# Altium schematic sheet TTL-RS485.SchDoc
size 420 x 297 mm; Author: Nguyễn Huy Hoàng; SheetNumber: 2; SheetTotal: 5; Instructor: Nguyễn Trung Hiếu
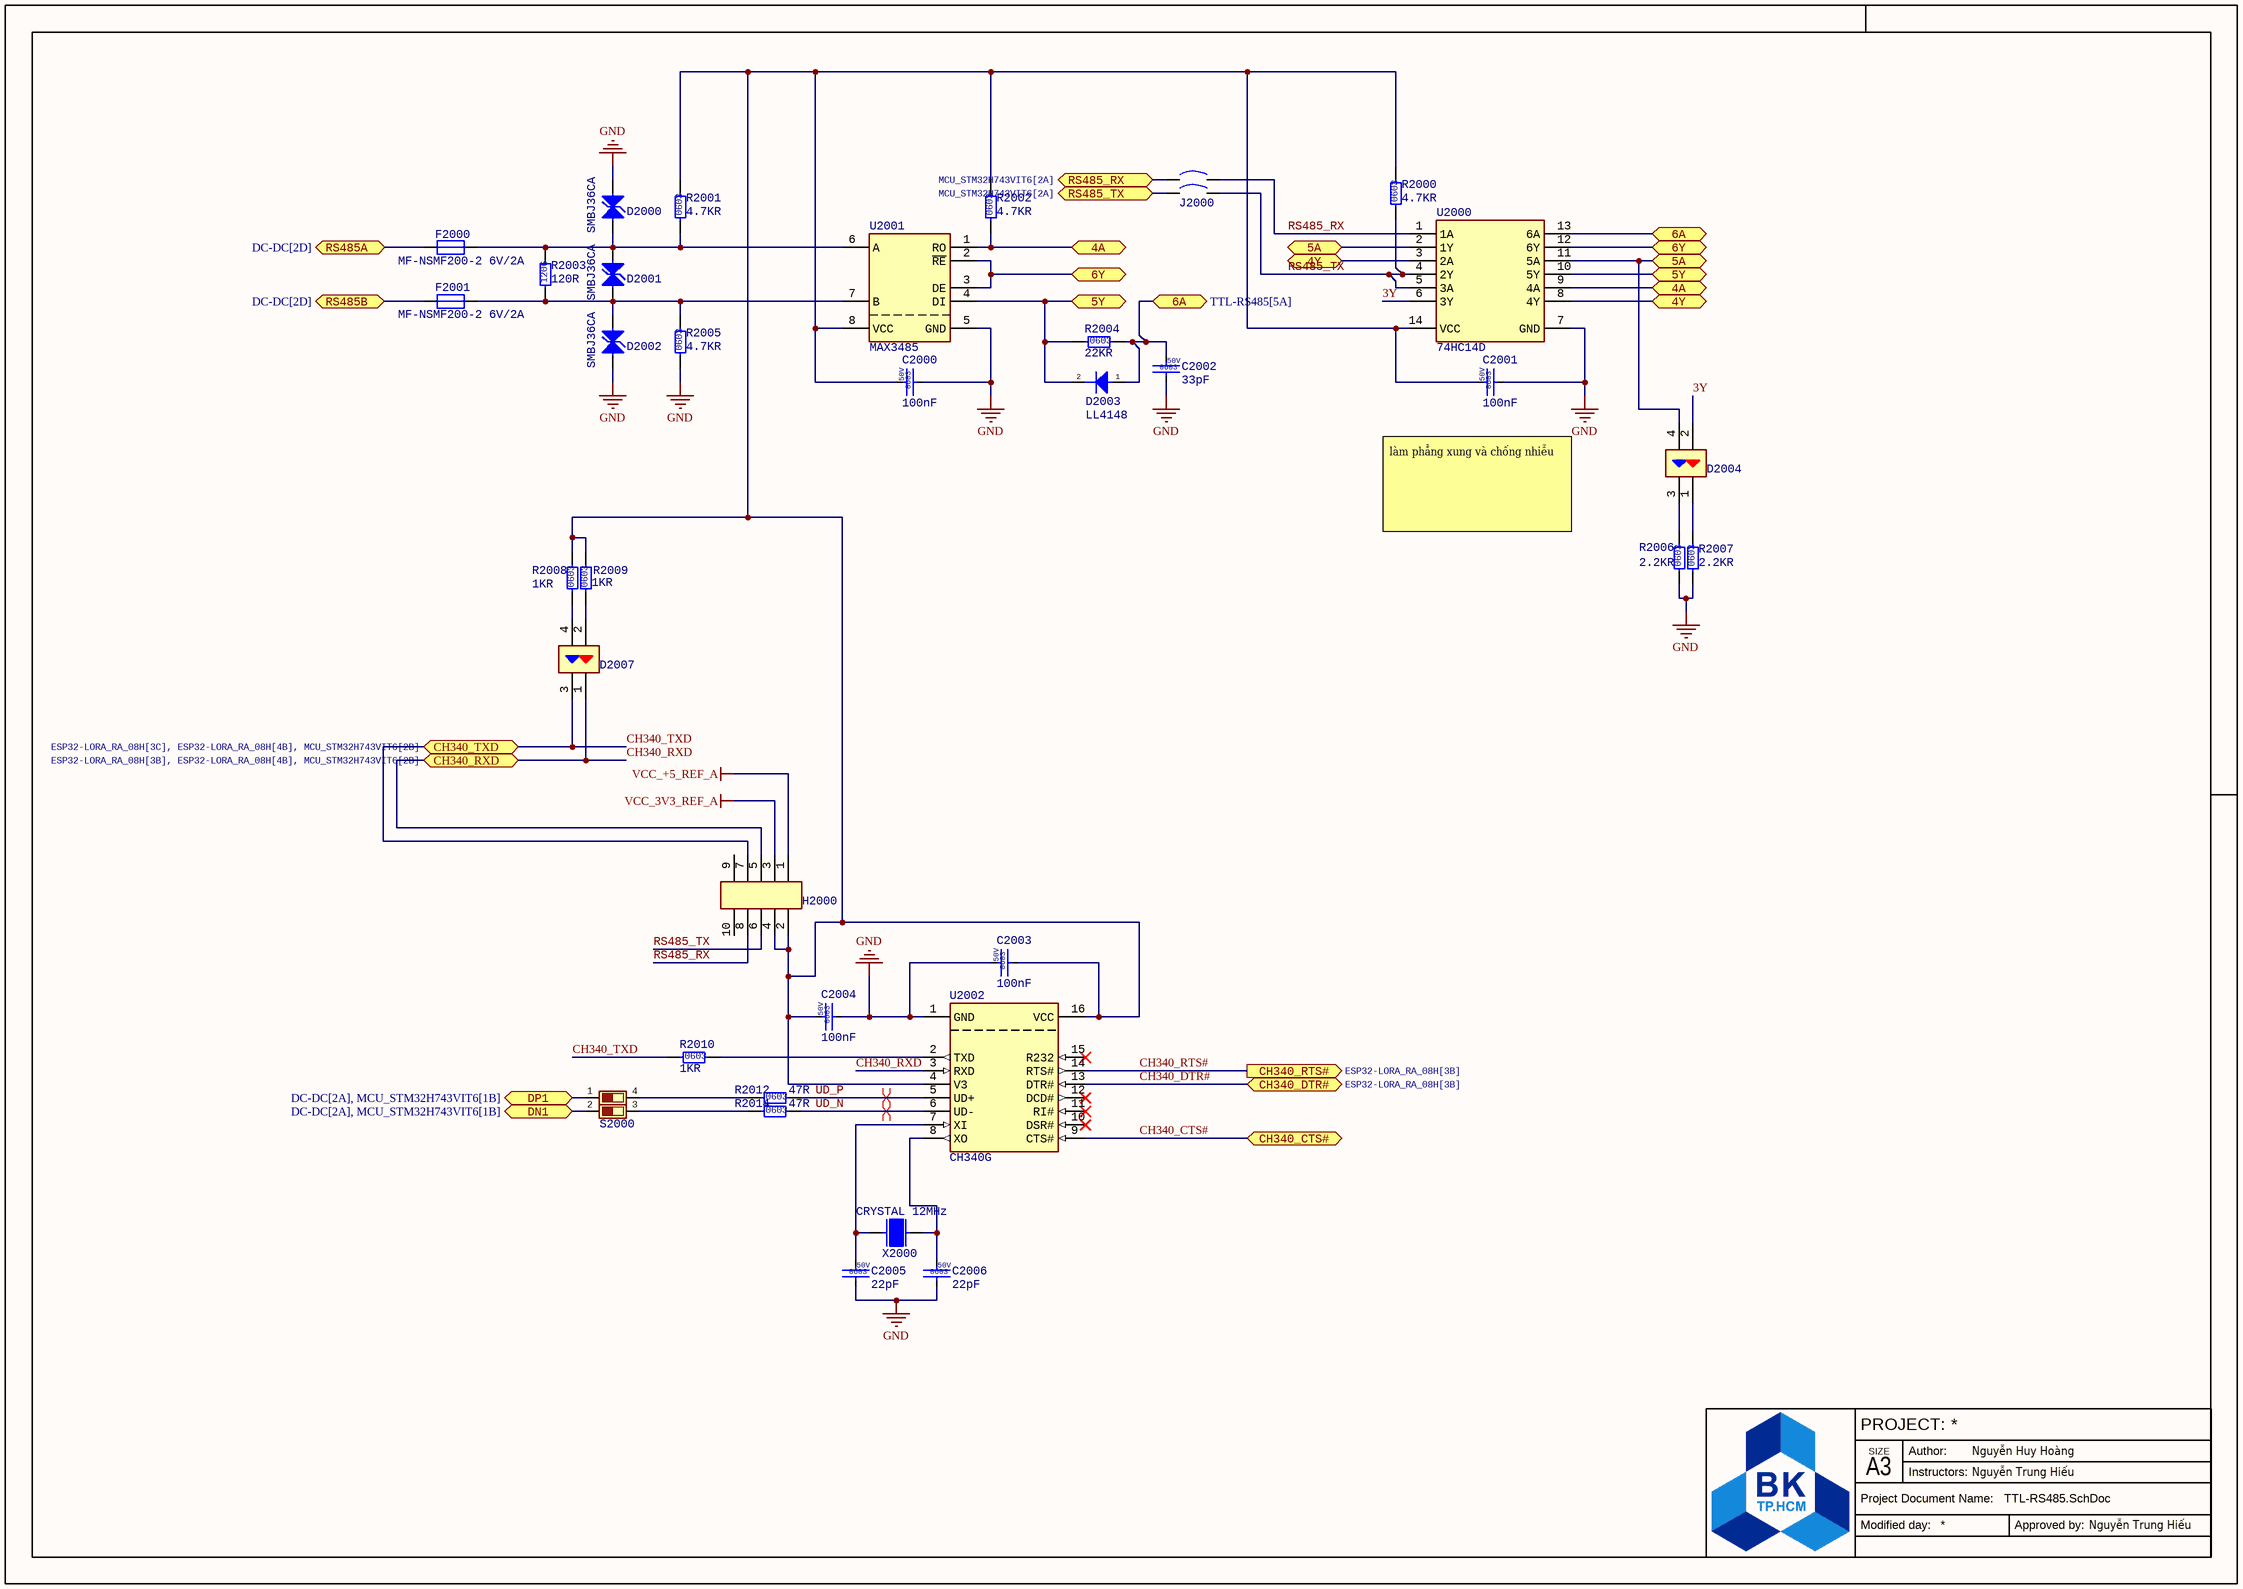
[diagram p0: TTL-RS485.SchDoc]

## Parts
C2000  100nF  Voltage: 50V  Size: 0603  [CAP CER 0603]
C2001  100nF  Voltage: 50V  Size: 0603  [CAP CER 0603]
C2002  33pF  Voltage: 50V  Size: 0603  [CAP CER 0603]
C2003  100nF  Voltage: 50V  Size: 0603  [CAP CER 0603]
C2004  100nF  Voltage: 50V  Size: 0603  [CAP CER 0603]
C2005  22pF  Voltage: 50V  Size: 0603  [CAP CER 0603]
C2006  22pF  Voltage: 50V  Size: 0603  [CAP CER 0603]
D2000  SMBJ36CA  [DO-214AA]
D2001  SMBJ36CA  [DO-214AA]
D2002  SMBJ36CA  [DO-214AA]
D2003  LL4148  [SOD-80]
D2004  LED R/B 0805  [LED RB 0805]  (value not drawn)
D2007  LED R/B 0805  [LED RB 0805]  (value not drawn)
F2000  MF-NSMF200-2 6V/2A  [FUSE 1206]
F2001  MF-NSMF200-2 6V/2A  [FUSE 1206]
H2000  HEADER 5X2  [HEADER 5X2]  (value not drawn)
J2000  JUMPER 2X2  [JUMPER 2X2]  (value not drawn)
R2000  4.7KR  Size: 0603  [RESC 0603(1608) SMD]
R2001  4.7KR  Size: 0603  [RESC 0603(1608) SMD]
R2002  4.7KR  Size: 0603  [RESC 0603(1608) SMD]
R2003  120R  Size: 1206  [RESC 1206(3116) SMD]
R2004  22KR  Size: 0603  [RESC 0603(1608) SMD]
R2005  4.7KR  Size: 0603  [RESC 0603(1608) SMD]
R2006  2.2KR  Size: 0603  [RESC 0603(1608) SMD]
R2007  2.2KR  Size: 0603  [RESC 0603(1608) SMD]
R2008  1KR  Size: 0603  [RESC 0603(1608) SMD]
R2009  1KR  Size: 0603  [RESC 0603(1608) SMD]
R2010  1KR  Size: 0603  [RESC 0603(1608) SMD]
R2012  47R  Size: 0603  [RESC 0603(1608) SMD]
R2014  47R  Size: 0603  [RESC 0603(1608) SMD]
S2000  DIP-2  [DIP-2 SWITCH]  (value not drawn)
U2000  74HC14D  [SOIC-14]
U2001  MAX3485  [SOP-8]
U2002  CH340G  [SOP-16]
X2000  CRYSTAL 12MHz  [CRYSTAL 5032 2PIN]

## Ports
4A (bidir, see TTL-RS485[3A]), 4A (bidir, see TTL-RS485[5A]), 4Y (bidir, see TTL-RS485[4A]), 4Y (bidir, see TTL-RS485[5A]), 5A (bidir, see TTL-RS485[4A]), 5A (bidir, see TTL-RS485[5A]), 5Y (bidir, see TTL-RS485[3A]), 5Y (bidir, see TTL-RS485[5A]), 6A (bidir, see TTL-RS485[4A]), 6A (bidir, see TTL-RS485[5A]), 6Y (bidir, see TTL-RS485[3A]), 6Y (bidir, see TTL-RS485[5A]), CH340_CTS# (bidir), CH340_DTR# (bidir, see ESP32-LORA_RA_08H[3B]), CH340_RTS# (out, see ESP32-LORA_RA_08H[3B]), CH340_RXD (bidir, see ESP32-LORA_RA_08H[3B], ESP32-LORA_RA_08H[4B], MCU_STM32H743VIT6[2B]), CH340_TXD (bidir, see ESP32-LORA_RA_08H[3C], ESP32-LORA_RA_08H[4B], MCU_STM32H743VIT6[2B]), DN1 (bidir, see DC-DC[2A], MCU_STM32H743VIT6[1B]), DP1 (bidir, see DC-DC[2A], MCU_STM32H743VIT6[1B]), RS485_RX (bidir, see MCU_STM32H743VIT6[2A]), RS485_TX (bidir, see MCU_STM32H743VIT6[2A]), RS485A (bidir, see DC-DC[2D]), RS485B (bidir, see DC-DC[2D])

## Nets
GND: C2000.2 C2001.2 C2002.2 C2003.1 C2004.2 C2005.2 C2006.2 D2000.1 D2002.2 R2005.1 R2006.1 R2007.1 U2000.7(GND) U2001.5(GND) U2002.1(GND)
VCC_3V3_REF_A: H2000.3
VCC_+5_REF_A: H2000.1
3Y: D2004.2 U2000.6(3Y)
4A: R2002.1 U2000.9(4A) U2001.1(RO) ; port 4A
4Y: U2000.3(2A) U2000.8(4Y) ; port 4Y
5A: D2004.4 U2000.2(1Y) U2000.11(5A) ; port 5A
5Y: D2003.2(K) R2004.1 U2000.10(5Y) U2001.4(DI) ; port 5Y
6A: C2002.1 D2003.1(A) R2004.2 U2000.13(6A) ; port 6A
6Y: U2000.12(6Y) U2001.2(~{RE}) U2001.3(DE) ; port 6Y
CH340_CTS#: U2002.9(CTS#) ; port CH340_CTS#
CH340_DTR#: U2002.13(DTR#) ; port CH340_DTR#
CH340_RTS#: U2002.14(RTS#) ; port CH340_RTS#
CH340_RXD: D2007.1 H2000.5 U2002.3(RXD) ; port CH340_RXD
CH340_TXD: D2007.3 H2000.7 R2010.1 ; port CH340_TXD
DN1: S2000.2 ; port DN1
DP1: S2000.1 ; port DP1
RS485_RX: H2000.8 J2000.2 U2000.1(1A)
RS485_RX: J2000.1 ; port RS485_RX  [a separate net that carries the same name]
RS485_TX: H2000.6 J2000.4 R2000.1 U2000.4(2Y) U2000.5(3A)
RS485_TX: J2000.3 ; port RS485_TX  [a separate net that carries the same name]
RS485A: F2000.1 ; port RS485A
RS485B: F2001.1 ; port RS485B
UD_N: R2014.2 U2002.6(UD-)
UD_P: R2012.2 U2002.5(UD+)
NetC2000_1: C2000.1 C2001.1 C2003.2 C2004.1 H2000.2 H2000.4 R2000.2 R2001.2 R2002.2 R2008.2 R2009.2 U2000.14(VCC) U2001.8(VCC) U2002.4(V3) U2002.16(VCC)
NetC2005_1: C2005.1 U2002.7(XI) X2000.1
NetC2006_1: C2006.1 U2002.8(XO) X2000.2
NetD2000_2: D2000.2 D2001.1 F2000.2 R2001.1 R2003.2 U2001.6(A)
NetD2001_2: D2001.2 D2002.1 F2001.2 R2003.1 R2005.2 U2001.7(B)
NetD2004_1: D2004.1 R2007.2
NetD2004_3: D2004.3 R2006.2
NetD2007_2: D2007.2 R2009.1
NetD2007_4: D2007.4 R2008.1
NetR2010_2: R2010.2 U2002.2(TXD)
NetR2012_1: R2012.1 S2000.4
NetR2014_1: R2014.1 S2000.3

Not connected (* = marked no-connect by the designer): H2000 9 10; U2002 10(DSR#)* 11(RI#)* 12(DCD#)* 15(R232)*

## Layout directives
differential pair: UD_N, UD_P

## Notes on the sheet
- làm phẳng xung và chống nhiễu
- PROJECT:
- SIZE
- Author:
- Instructors:
- Project Document Name:
- Modified day:
- A3
- Approved by:

## Library data of the parts
C2000 C2001 C2003 C2004 = FF-1008: CAP CER SMD 100nF 10% 50V 0603; Type: CAP CER; Value: 100nF; Design Item ID: FF-1008; TH/SMD: SMD; Tolerance: 10%; Power Rate: N/A; Supplier: THEGIOIIC; Supplier Link: https://www.thegioiic.com/tu-gom-0603-100nf-0-1uf-50v; Supplier Part Number: 10%, 0603 (1608 Metric)
C2002 = FF-1007: CAP CER SMD 33pF 10% 50V 0603; Type: CAP CER; Value: 33pF; Design Item ID: FF-1007; TH/SMD: SMD; Tolerance: 10%; Power Rate: N/A; Supplier: THEGIOIIC; Supplier Part Number: 10%, 0603 (1608 Metric); Supplier Link: https://www.thegioiic.com/tu-gom-0603-33pf-50v
C2005 C2006 = FF-1032: CAP CER SMD 22pF 10% 50V 0603; Type: CAP CER; Design Item ID: FF-1032; TH/SMD: SMD; Value: 22pF; Tolerance: 10%; Power Rate: N/A; Supplier: THEGIOIIC; Supplier Part Number: 10%, 0603 (1608 Metric); Supplier Link: https://www.thegioiic.com/tu-gom-0603-22pf-50v
D2000-D2002 = FF-4014: TVS DIODE 36V 58.1V DO214AA; TH/SMD: SMD; Design Item ID: FF-4014; Type: TVS DIODE; Value: 36V 58.1V; Tolerance: N/A; Voltage: 36V 58.1V; Power Rate: N/A; Size: DO214AA; Supplier: THEGIOIIC; Supplier Part Number: SMBJ36CA; Supplier Link: https://www.thegioiic.com/smbj36ca
D2003 = FF-4013: 0.2A, 100V, SOD80; TH/SMD: SMD; Value: 100V/0.2A; Design Item ID: FF-4013; Type: DIODE; Tolerance: N/A; Voltage: 100V; Power Rate: N/A; Size: SOD-80; Supplier: THEGIOIIC; Supplier Part Number: LL4148; Supplier Link: https://www.thegioiic.com/ll4148-diode-chinh-luu-0-2a-100v
D2004 D2007 = FF-4019: LED 2 Màu Đỏ, Xanh Dương 0805 Dán SMD Trong Suốt; Type: LED R/B; Value: 0805; Design Item ID: FF-4019; TH/SMD: SMD; Tolerance: N/A; Voltage: N/A; Power Rate: N/A; Size: 0805; Supplier: THEGIOIIC; Supplier Part Number: LED 2 Màu Đỏ, Xanh Dương 0805 Dán SMD Trong Suốt; Supplier Link: https://www.thegioiic.com/led-2-mau-do-xanh-duong-0805-dan-smd-trong-suot
F2000 F2001 = FF-4008: Size: 3.2x1.6 mm, -40°C ~ 85°C; TH/SMD: SMD; Voltage: 6V; Value: 6V/2A; Design Item ID: FF-4008; Type: FUSE; Tolerance: N/A; Power Rate: N/A; Size: 1206; Supplier: THEGIOIIC; Supplier Part Number: MF-NSMF200-2; Supplier Link: https://www.thegioiic.com/mf-nsmf200-2-cau-chi-tu-phuc-hoi-1206-6v-2a
H2000 = FF-3020: TH/SMD: TH; Design Item ID: FF-3020; Type: JUMPER; Value: N/A; Tolerance: N/A; Voltage: N/A; Power Rate: N/A; Size: 5X2 X 2.54mm; Supplier: N/A; Supplier Part Number: N/A; Supplier Link: N/A
J2000 = FF-3019: TH/SMD: TH; Design Item ID: FF-3019; Type: JUMPER; Value: N/A; Tolerance: N/A; Voltage: N/A; Power Rate: N/A; Size: 2X2 X 2.54mm; Supplier: N/A; Supplier Part Number: N/A; Supplier Link: N/A
R2000-R2002 R2005 = FF-0016: RESISTOR SMD 4.7KR OHM 1% 100mW 0603; Type: RESISTOR; TH/SMD: SMD; Value: 4.7KR; Tolerance: 1%; Voltage: N/A; Power Rate: 100mW; Supplier: THEGIOIIC; Supplier Part Number: 472, 1/10W; Supplier Link: https://www.thegioiic.com/dien-tro-4-7-kohm-0603-1-; Design Item ID: FF-0016
R2003 = FF-0033: RESISTOR SMD 120R OHM 1% 250mW 1206; Type: RESISTOR; TH/SMD: SMD; Value: 120R; Tolerance: 1%; Voltage: N/A; Power Rate: 250mW; Supplier: THEGIOIIC; Supplier Part Number: 121, 1/4W; Supplier Link: https://www.thegioiic.com/dien-tro-120-ohm-1206-1-; Design Item ID: FF-0033
R2004 = FF-0025: RESISTOR SMD 22KR OHM 1% 100mW 0603; Type: RESISTOR; TH/SMD: SMD; Value: 22KR; Tolerance: 1%; Voltage: N/A; Power Rate: 100mW; Supplier: THEGIOIIC; Supplier Part Number: 223, 1/10W; Supplier Link: https://www.thegioiic.com/dien-tro-22-kohm-0603-1-; Design Item ID: FF-0025
R2006 R2007 = FF-0009: RESISTOR SMD 2.2KR OHM 1% 100mW 0603; Type: RESISTOR; TH/SMD: SMD; Value: 2.2KR; Tolerance: 1%; Voltage: N/A; Power Rate: 100mW; Supplier: THEGIOIIC; Supplier Part Number: 222, 1/10W; Supplier Link: https://www.thegioiic.com/dien-tro-2-2-kohm-0603-1-; Design Item ID: FF-0009
R2008-R2010 = FF-0037: RESISTOR SMD 1KR OHM 1% 100mW 0603; Power Rate: 100mW; Design Item ID: FF-0037; Type: RESISTOR; TH/SMD: SMD; Value: 1KR; Tolerance: 1%; Voltage: N/A; Supplier: THEGIOIIC; Supplier Part Number: Code 102, 1/10W; Supplier Link: https://www.thegioiic.com/dien-tro-1-kohm-0603-1-
R2012 R2014 = FF-0028: RESISTOR SMD 47R OHM 1% 100mW 0603; Power Rate: 100mW; Design Item ID: FF-0028; Type: RESISTOR; TH/SMD: SMD; Value: 47R; Tolerance: 1%; Voltage: N/A; Supplier: THEGIOIIC; Supplier Part Number: 47R (Code 470), 1/10W; Supplier Link: https://www.thegioiic.com/dien-tro-47-ohm-0603-1-
S2000 = FF-3009: DIP SWITCH 1.27mm 2 CONTACT; TH/SMD: SMD; Design Item ID: FF-3009; Type: SWITCH; Value: N/A; Tolerance: N/A; Voltage: N/A; Power Rate: N/A; Size: 2 X 1.27mm; Supplier: THEGIOIIC; Supplier Part Number: Công Tắc DIP Switch Dán SMD 2 Bit 1.27mm; Supplier Link: https://www.thegioiic.com/cong-tac-dip-switch-dan-smd-2-bit-1-27mm
U2000 = FF-2001: Inverters HEX INV SCHMITT TRIG; TH/SMD: SMD; Design Item ID: FF-2001; Type: IC; Value: 74HC14D; Tolerance: N/A; Voltage: N/A; Power Rate: N/A; Size: SOIC-14; Supplier: THEGIOIIC; Supplier Part Number: 74HC14D,652; Supplier Link: https://www.thegioiic.com/74hc14d-652-hex-schmitt-trigger-inverter-14-soic
U2001 = FF-2009: 3.3V, 10Mbps Half-Duplex RS-485/RS-422 Transceivers; TH/SMD: SMD; Design Item ID: FF-2009; Type: IC; Value: MAX3485; Tolerance: N/A; Voltage: N/A; Power Rate: N/A; Size: SOP-8; Supplier: THEGIOIIC
U2002 = FF-2021: CH340G USB to UART Interface; TH/SMD: SMD; Design Item ID: FF-2021; Type: IC; Value: CH340G; Tolerance: N/A; Voltage: N/A; Power Rate: N/A; Size: SOP-16; Supplier: THEGIOIIC; Supplier Part Number: CH340G; Supplier Link: https://www.thegioiic.com/ch340g
X2000 = FF-4020: CRYSTAL 12MHz 2PIN SMD 5 x 3.2mm, ±20ppm 12pF; Design Item ID: FF-4020; Type: CRYSTAL; TH/SMD: SMD; Value: 12MHz; Tolerance: N/A; Voltage: N/A; Power Rate: N/A; Size: 5032; Supplier: THEGIOIIC; Supplier Part Number: Thạch Anh 12MHz 5032 2 Chân SMD; Supplier Link: https://www.thegioiic.com/thach-anh-12mhz-5032-2-chan-smd